# EAGLE schematic main (EAGLE 6.3)
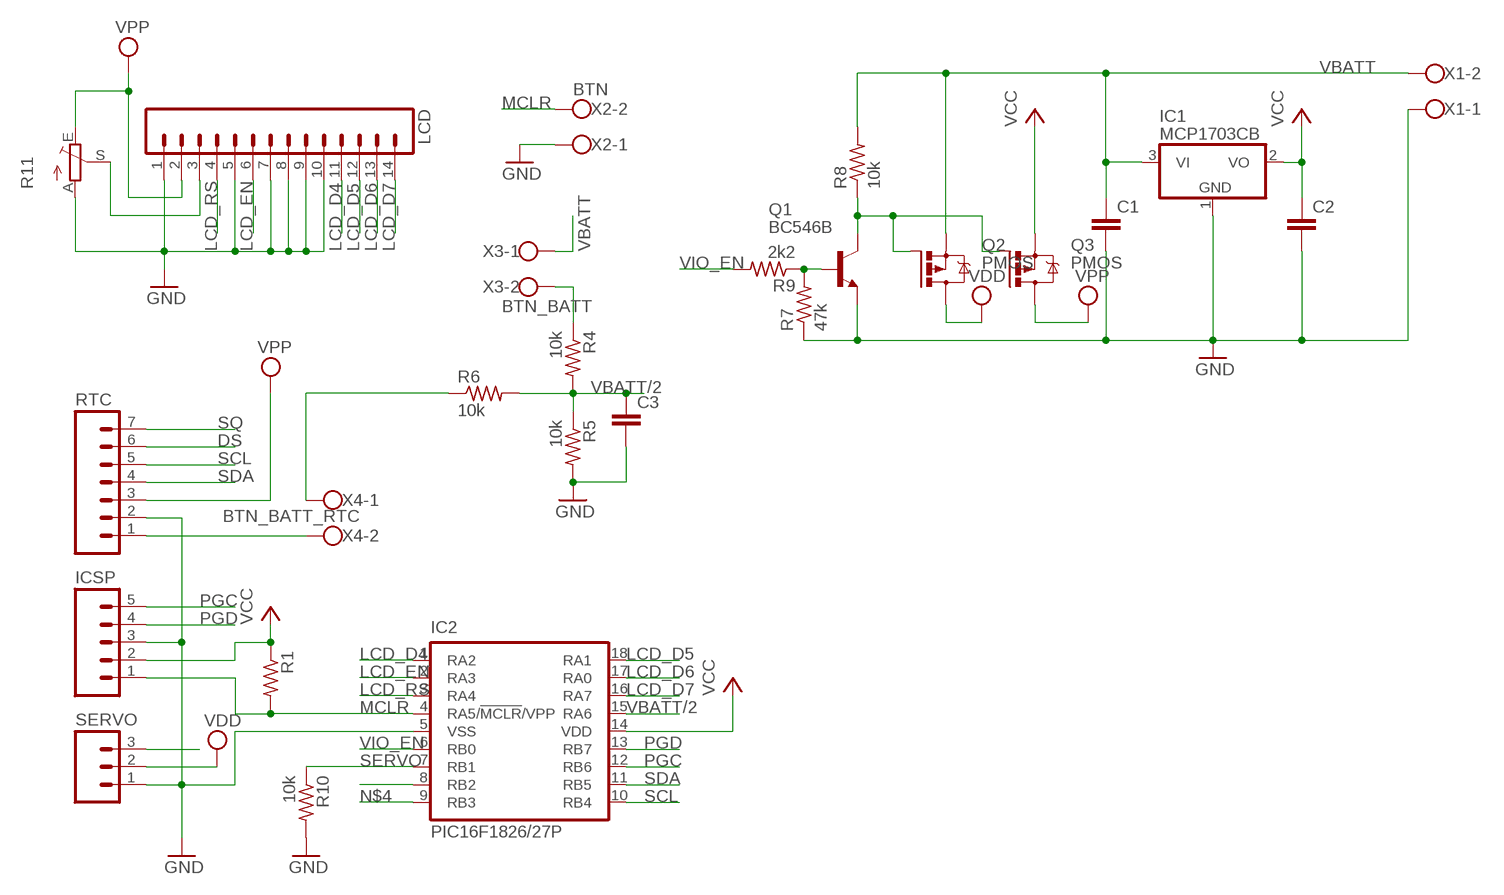
[diagram p0: schematic, sheet 1]

## Parts
C1  C-EUC0805K  [C0805K]
C2  C-EUC0805K  [C0805K]
C3  C-EUC0805K  [C0805K]
IC1  MCP1703CB  [SOT23]
IC2  PIC16F1826/27P  [DIL18]
ICSP  M05  [05P]
LCD  M14  [14P]
Q1  BC546B  [TO92-EBC]
Q2  PMOS  IRLML5203  [MICRO3]
Q3  PMOS  IRLML5203  [MICRO3]
R1  R-US_0207/10  [0207/10]
R4  10k  R-US_R1005  [R1005]
R5  10k  R-US_R1005  [R1005]
R6  10k  R-US_R1005  [R1005]
R7  47k  R-US_R1005  [R1005]
R8  10k  R-US_R1005  [R1005]
R9  2k2  R-US_R1005  [R1005]
R10  10k  R-US_R1005  [R1005]
R11  TRIM_EU-LI10  [LI10]
RTC  M07  [07P]
SERVO  M03  [03P]
X1  W237-102  [W237-102]
X2  BTN  W237-102  [W237-102]
X3  BTN_BATT  W237-102  [W237-102]
X4  BTN_BATT_RTC  W237-102  [W237-102]

## Nets
BTN_BATT_RTC: R6.1 X4.1
DS: RTC.6
GND: C1.2 C2.2 C3.2 IC1.1(GND) IC2.5(VSS) ICSP.3 LCD.1 LCD.5 LCD.7 LCD.8 LCD.9 LCD.10 Q1.E R5.2 R7.1 R10.2 R11.A RTC.2 SERVO.1 X1.1 X2.1
LCD_D4: IC2.1(RA2) LCD.11
LCD_D5: IC2.18(RA1) LCD.12
LCD_D6: IC2.17(RA0) LCD.13
LCD_D7: IC2.16(RA7) LCD.14
LCD_EN: IC2.2(RA3) LCD.6
LCD_RS: IC2.3(RA4) LCD.4
MCLR: IC2.4(RA5/!MCLR!/VPP) ICSP.1 R1.2 X2.2
N$1: LCD.3 R11.S
N$2: Q1.B R7.2 R9.1
N$3: RTC.1 X4.2
N$4: IC2.9(RB3)
N$5: IC2.8(RB2)
N$7: R4.1 X3.2
PGC: IC2.12(RB6) ICSP.5
PGD: IC2.13(RB7) ICSP.4
SCL: IC2.10(RB4) RTC.5
SDA: IC2.11(RB5) RTC.4
SERVO: IC2.7(RB1) R10.1 SERVO.3
SQ: RTC.7
VBATT: C1.1 IC1.3(VI) Q2.2(S) R8.2 X1.2 X3.1
VBATT/2: C3.1 IC2.15(RA6) R4.2 R5.1 R6.2
VCC: C2.1 IC1.2(VO) IC2.14(VDD) ICSP.2 Q3.2(S) R1.1
VDD: Q2.3(D) SERVO.2
VGIO: Q1.C Q2.1(G) Q3.1(G) R8.1
VIO_EN: IC2.6(RB0) R9.2
VPP: LCD.2 Q3.3(D) R11.E RTC.3

## Library data of the parts
C1-C3 = rcl:C-EU: CAPACITOR, European symbol
IC1 = linear:MCP1703: 250 mA, 16V, Low Quiescent Current LDO Regulator Source: http://ww1.microchip.com/downloads/en/DeviceDoc/22049b.pdf
IC2 = microchip:PIC16*F1826/27: 18/20/28-Pin Flash Microcontrollers with nanoWatt XLP Technology Source: www.microchip.com PIC16F1827.pdf
ICSP = con-amp-quick:M05: AMP QUICK CONNECTOR; OC_FARNELL: unknown; OC_NEWARK: unknown
LCD = con-amp-quick:M14: AMP QUICK CONNECTOR; OC_FARNELL: unknown; OC_NEWARK: unknown
Q1 = transistor-npn:BC546*: NPN Transistor
Q2 Q3 = transistor-power:IRLML5203: HEXFET P-Channel Power MOSFET
R1 R4-R10 = rcl:R-US_: RESISTOR, American symbol
R11 = pot:TRIM_EU-: POTENTIOMETER
RTC = con-amp-quick:M07: AMP QUICK CONNECTOR; OC_FARNELL: unknown; OC_NEWARK: unknown
SERVO = con-amp-quick:M03: AMP QUICK CONNECTOR; OC_FARNELL: unknown; OC_NEWARK: unknown
X1-X4 = con-wago-500:W237-102: WAGO SCREW CLAMP; MPN: 237-102; OC_FARNELL: unknown; OC_NEWARK: 70K9898